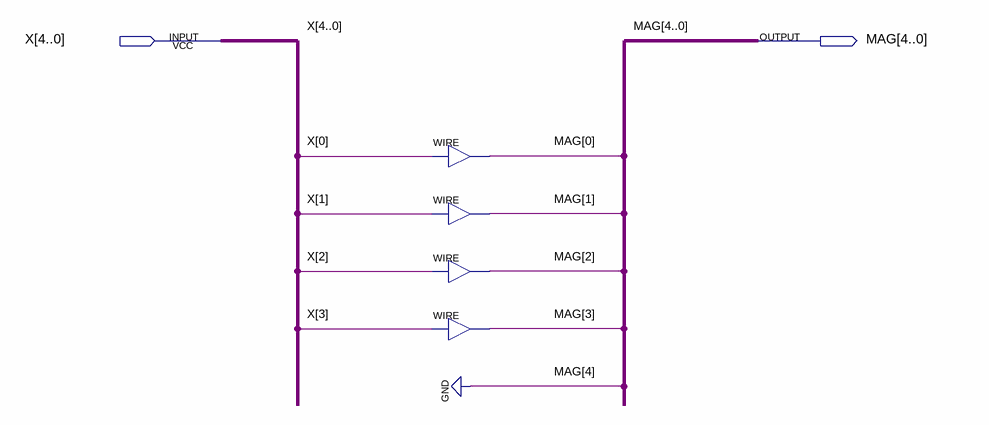
[diagram p0: schematic sheet]
// Quartus schematic MAG_ENTRADA.bdf as structural Verilog: 4 symbols, 2 pins
module MAG_ENTRADA (
  input  [4:0] X,
  output [4:0] MAG
);

  assign MAG[0] = X[0];  // WIRE map_MAG_0
  assign MAG[1] = X[1];  // WIRE map_MAG_1
  assign MAG[2] = X[2];  // WIRE map_MAG_2
  assign MAG[3] = X[3];  // WIRE map_MAG_3

  assign MAG[4] = 1'b0;
endmodule
